# EAGLE design Cleanroom Nano (EAGLE 6.2)
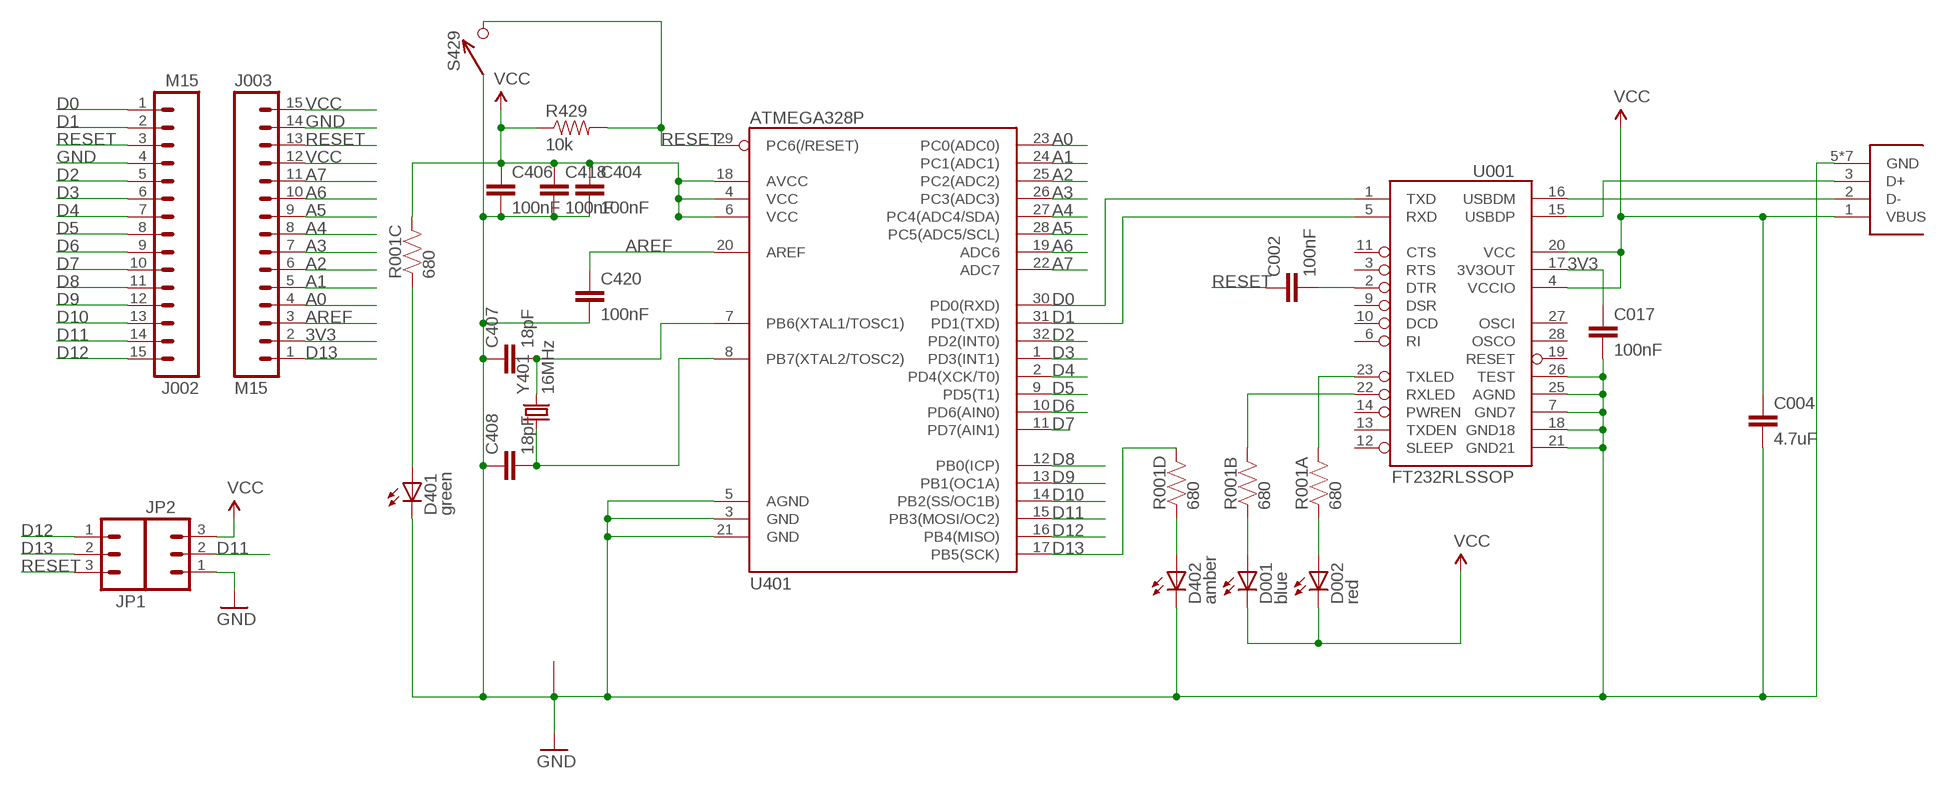
[diagram p0: schematic, sheet 1]

## Parts
C002  100nF  CAP0402-CAP  [0402-CAP]
C004  4.7uF  CAP0402-CAP  [0402-CAP]
C017  100nF  CAP0402-CAP  [0402-CAP]
C404  100nF  CAP0402-CAP  [0402-CAP]
C406  100nF  CAP0402-CAP  [0402-CAP]
C407  18pF  CAP0402-CAP  [0402-CAP]
C408  18pF  CAP0402-CAP  [0402-CAP]
C418  100nF  CAP0402-CAP  [0402-CAP]
C420  100nF  CAP0402-CAP  [0402-CAP]
D001  blue  LED0603  [LED-0603]
D002  red  LED0603  [LED-0603]
D401  green  LED0603  [LED-0603]
D402  amber  LED0603  [LED-0603]
J001  USB_MICROB_JST  [UB-MC5BR3-SD204-4S]
J002  M15  [1X15]
J003  M15  [1X15]
JP1  M03PTH  [1X03]
JP2  M03PTH  [1X03]
R001  680  RP404  [CRA04]
R429  10k  RESISTOR0402-RES  [0402-RES]
S429  B3U-1000P  [B3U-1000P]
U001  FT232RLSSOP  [SSOP28DB]
U401  ATMEGA328P  ATMEGA168  [TQFP32-08]
Y401  16MHz  CX2520  [CRYSTAL_SMD_2MM_2_5MM]

## Nets
3V3: C017.1 J003.2 U001.17(3V3OUT)
A0: J003.4 U401.23(PC0(ADC0))
A1: J003.5 U401.24(PC1(ADC1))
A2: J003.6 U401.25(PC2(ADC2))
A3: J003.7 U401.26(PC3(ADC3))
A4: J003.8 U401.27(PC4(ADC4/SDA))
A5: J003.9 U401.28(PC5(ADC5/SCL))
A6: J003.10 U401.19(ADC6)
A7: J003.11 U401.22(ADC7)
AREF: C420.1 J003.3 U401.20(AREF)
D0: J002.1 U001.1(TXD) U401.30(PD0(RXD))
D1: J002.2 U001.5(RXD) U401.31(PD1(TXD))
D2: J002.5 U401.32(PD2(INT0))
D3: J002.6 U401.1(PD3(INT1))
D4: J002.7 U401.2(PD4(XCK/T0))
D5: J002.8 U401.9(PD5(T1))
D6: J002.9 U401.10(PD6(AIN0))
D7: J002.10 U401.11(PD7(AIN1))
D8: J002.11 U401.12(PB0(ICP))
D9: J002.12 U401.13(PB1(OC1A))
D10: J002.13 U401.14(PB2(SS/OC1B))
D11: J002.14 JP2.2 U401.15(PB3(MOSI/OC2))
D12: J002.15 JP1.1 U401.16(PB4(MISO))
D13: J003.1 JP1.2 R001.5 U401.17(PB5(SCK))
DTR#: C002.2 U001.2(DTR)
GND: C004.2 C017.2 C404.2 C406.2 C407.1 C408.1 C418.2 C420.2 D401.C D402.C J001.5(GND) J001.P$6(GND) J001.P$7(GND) J001.P$8(GND) J001.P$9(GND) J001.P$10(GND) J001.P$11(GND) J002.4 J003.14 JP2.1 S429.P$1 U001.7(GND7) U001.18(GND18) U001.21(GND21) U001.25(AGND) U001.26(TEST) U401.3(GND) U401.5(AGND) U401.21(GND) Y401.2 Y401.4
N$1: C407.2 U401.7(PB6(XTAL1/TOSC1)) Y401.3
N$2: C408.2 U401.8(PB7(XTAL2/TOSC2)) Y401.1
N$3: J001.3(D+) U001.15(USBDP)
N$4: J001.2(D-) U001.16(USBDM)
N$5: D401.A R001.3
N$8: D402.A R001.4
N$9: D002.A R001.1
N$11: D001.A R001.2
RESET: C002.1 J002.3 J003.13 JP1.3 R429.2 S429.P$2 U401.29(PC6(/RESET))
RXLED1: R001.7 U001.22(RXLED)
TXLED1: R001.8 U001.23(TXLED)
VCC: C004.1 C404.1 C406.1 C418.1 D001.C D002.C J001.1(VBUS) J003.12 J003.15 JP2.3 R001.6 R429.1 U001.4(VCCIO) U001.20(VCC) U401.4(VCC) U401.6(VCC) U401.18(AVCC)
Unconnected: U001.3(RTS) U001.6(RI) U001.9(DSR) U001.10(DCD) U001.11(CTS) U001.12(SLEEP) U001.13(TXDEN) U001.14(PWREN) U001.19(RESET) U001.27(OSCI) U001.28(OSCO)

## Library data of the parts
C002 C004 C017 C404 C406-C408 C418 C420 = SparkFun:CAP: Capacitor Standard 0603 ceramic capacitor, and 0.1" leaded capacitor.
D001 D002 D401 D402 = SparkFun-LED:LED: LEDs Standard schematic elements and footprints for 5mm, 3mm, 1206, and 0603 sized LEDs. 5mm - Spark Fun Electronics SKU : COM-00529 (and others)
J001 = KwanSystems:USB_MICROB_JST
J002 J003 = SparkFun-Connectors:M15: Header 15 Standard 15-pin 0.1" header. Use with straight break away headers (SKU : PRT-00116), right angle break away headers (PRT-00553), swiss pins (PRT-00743), machine pins (PRT-00117), and female headers (PRT-00115).
JP1 JP2 = SparkFun:M03: Header 3 Standard 3-pin 0.1" header. Use with straight break away headers (SKU : PRT-00116), right angle break away headers (PRT-00553), swiss pins (PRT-00743), machine pins (PRT-00117), and female headers (PRT-00115). Molex polarized connector foot print use with SKU : PRT-08232 with associated crimp pins and housings.
R001 = KwanSystems:RP4
R429 = SparkFun-Passives:RESISTOR: Resistor Basic schematic elements and footprints for 0603, 1206, and PTH resistors.
S429 = KwanSystems:B3U-1000P
U001 = SparkFun-DigitalIC:FT232RL: USB UART FT232RL 4th Generation USB UART (USB <-> Serial) Controller. Spark Fun Electronics SKU : COM-00650
U401 = SparkFun-DigitalIC:ATMEGA168: Atmel 32-pin 8-bit micro, 16k flash.
Y401 = KwanSystems:CX2520

## Net classes
0 default: width 0.152 mm, drill 0.33 mm, clearance 0.152 mm

## Board
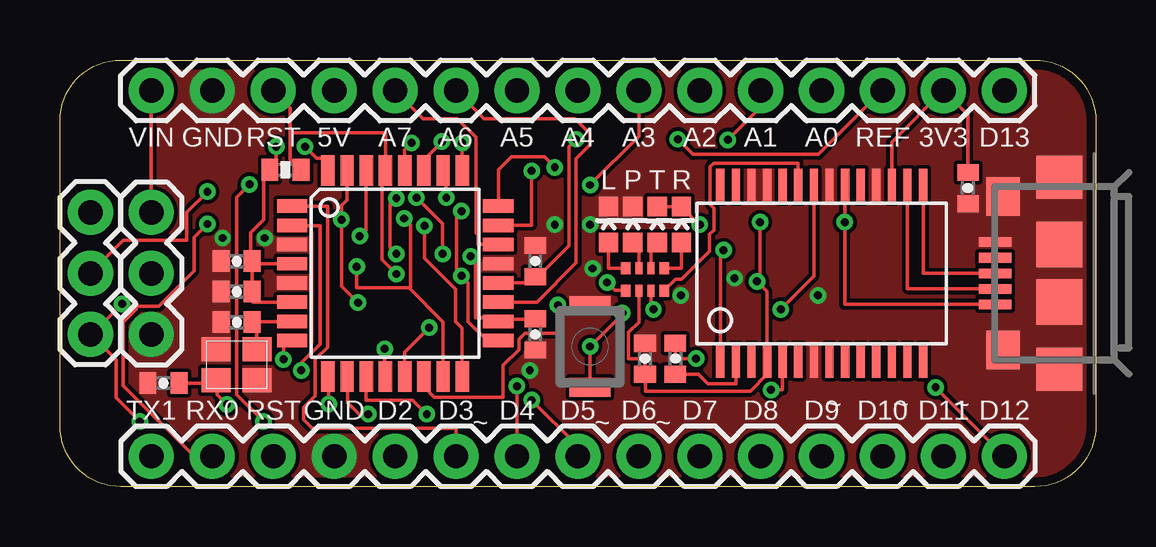
[diagram p1: board, top side]
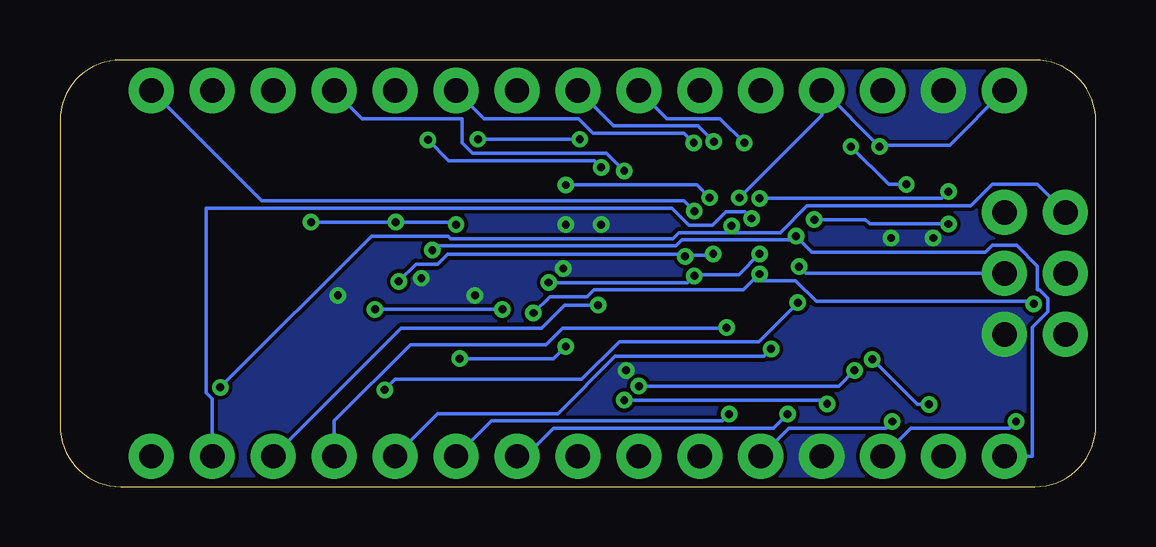
[diagram p2: board, bottom side, seen from below]

Size 43.18 x 17.78 mm. Coordinates in mm from the lower left corner, seen from the top.
Outline: 40.64,0 2.54,0 arc-90 0,2.54 0,15.24 arc-90 2.54,17.78 40.64,17.78 arc-90 43.18,15.24 43.18,2.54 arc-90 40.64,0
Copper layers (1*16): Top 0.0356mm / dielectric 1.5011mm / Bottom 0.0356mm
Design rules: minimum track width 6mil, minimum drill 13mil, track to track 6mil, track to pad 6mil, pad to pad 6mil, via to via 6mil, smd to smd 6mil, copper to edge 15mil, drill to drill 6mil, minimum pad ring 7mil, minimum via ring 7mil, stop-mask expansion 4mil, vias tented up to drill 0mil, thermal gap 10mil

### Footprints (pad centres in the part's own frame; a part is rotated, then mirrored left to right if it is on the bottom)
0402-CAP = smd 0.7 x 0.9: 1 -0.65,0; 2 0.65,0
LED-0603 = smd 0.8 x 0.8: A 0,-0.75; C 0,0.75
UB-MC5BR3-SD204-4S = smd 0.4 x 1.35: 1 -1.3,2.675; 2 -0.65,2.675; 3 0,2.675; 4 0.65,2.675; 5 1.3,2.675 | smd 1.8 x 1.9: P$6 4,0; P$7 -4,0 | smd 1.9 x 1.9: P$8 -1.2,0; P$9 1.2,0 | smd 1.6 x 1.4: P$10 -3.2,2.35; P$11 3.2,2.35
1X15 = drill 1.016 pad 1.88: 1 0,0; 2 2.54,0; 3 5.08,0; 4 7.62,0; 5 10.16,0; 6 12.7,0; 7 15.24,0; 8 17.78,0; 9 20.32,0; 10 22.86,0; 11 25.4,0; 12 27.94,0; 13 30.48,0; 14 33.02,0; 15 35.56,0
1X03 = drill 1.016 pad 1.88: 1 0,0; 2 2.54,0; 3 5.08,0
CRA04 = smd 0.4 x 0.5: 1 -0.8,-0.475; 4 0.8,-0.475; 5 0.8,0.475; 8 -0.8,0.475 | smd 0.3 x 0.5: 2 -0.25,-0.475; 3 0.25,-0.475; 6 0.25,0.475; 7 -0.25,0.475
0402-RES = smd 0.7 x 0.9: 1 -0.65,0; 2 0.65,0
B3U-1000P = smd 0.8 x 1.7: P$1 -1.7,0; P$2 1.7,0
SSOP28DB = smd 0.348 x 1.397: 1 -4.225,-3.656; 2 -3.575,-3.656; 3 -2.925,-3.656; 4 -2.275,-3.656; 5 -1.625,-3.656; 6 -0.975,-3.656; 7 -0.325,-3.656; 8 0.325,-3.656; 9 0.975,-3.656; 10 1.625,-3.656; 11 2.275,-3.656; 12 2.925,-3.656; 13 3.575,-3.656; 14 4.225,-3.656; 15 4.225,3.656; 16 3.575,3.656; 17 2.925,3.656; 18 2.275,3.656; 19 1.625,3.656; 20 0.975,3.656; 21 0.325,3.656; 22 -0.325,3.656; 23 -0.975,3.656; 24 -1.625,3.656; 25 -2.275,3.656; 26 -2.925,3.656; 27 -3.575,3.656; 28 -4.225,3.656
TQFP32-08 = smd 1.27 x 0.559: 1 -4.293,2.8; 2 -4.293,2; 3 -4.293,1.2; 4 -4.293,0.4; 5 -4.293,-0.4; 6 -4.293,-1.2; 7 -4.293,-2; 8 -4.293,-2.8; 17 4.293,-2.8; 18 4.293,-2; 19 4.293,-1.2; 20 4.293,-0.4; 21 4.293,0.4; 22 4.293,1.2; 23 4.293,2; 24 4.293,2.8 | smd 0.559 x 1.27: 9 -2.8,-4.293; 10 -2,-4.293; 11 -1.2,-4.293; 12 -0.4,-4.293; 13 0.4,-4.293; 14 1.2,-4.293; 15 2,-4.293; 16 2.8,-4.293; 25 2.8,4.293; 26 2,4.293; 27 1.2,4.293; 28 0.4,4.293; 29 -0.4,4.293; 30 -1.2,4.293; 31 -2,4.293; 32 -2.8,4.293
CRYSTAL_SMD_2MM_2_5MM = smd 1.2 x 1: 1 -0.85,-0.65; 2 0.85,-0.65; 3 0.85,0.65; 4 -0.85,0.65

### Placement (x,y rotation side)
C002  25.65,5.33 270 top
C004  24.38,5.33 90 top
C017  37.85,12.45 270 top
C404  7.37,9.4 180 top
C406  7.37,8.13 180 top
C407  7.37,6.86 0 top
C408  4.32,4.32 0 top
C418  19.81,6.35 270 top
C420  19.81,9.4 90 top
D001  24.89,10.92 0 top
D002  25.91,10.92 0 top
D401  23.88,10.92 0 top
D402  22.86,10.92 0 top
J001  41.66,8.89 90 top
J002  3.81,1.27 0 top
J003  39.37,16.51 180 top
JP1  1.27,11.43 270 top
JP2  3.81,6.35 90 top
R001  24.38,8.64 180 top
R429  9.4,13.21 0 top
S429  22.1,5.84 270 top
U001  31.75,8.89 0 top
U401  13.97,8.89 0 top
Y401  7.37,5.08 0 top

### Tracks (layer width: path | path; a pad name or v marks a point on that pad's centre or on a via)
3V3
  Top 0.152: U001.17 34.67,14.36 J003.2 37.85,15.49 C017.1
A0  (via drill 0.33)
  Top 0.152: v19.66,13.16 19.66,10.9 U401.23
  Bottom 0.152: v19.66,13.16 20.4,13.89 25.98,13.89 26.42,14.33 26.42,15.34 30.58,15.34 J003.4
A1  (via drill 0.33)
  Top 0.152: v27.84,14.45 29.21,15.82 J003.5 | v20.62,13.31 20.19,13.74 18.82,13.74 18.29,13.21 18.29,11.71 U401.24
  Bottom 0.152: v20.62,13.31 20.9,13.59 26.98,13.59 v27.84,14.45
A2  (via drill 0.33)
  Top 0.152: v16.76,14.33 U401.25
  Bottom 0.152: v16.76,14.33 17.17,14.73 20.95,14.73 21.57,15.34 25.5,15.34 J003.6
A3  (via drill 0.33)
  Top 0.152: v16.1,12.04 16.1,13.06 U401.26 | v22.1,12.57 24.13,14.61 J003.7
  Bottom 0.152: v16.1,12.04 16.64,12.57 v22.1,12.57
A4  (via drill 0.33)
  Top 0.152: v15.93,14.38 15.17,13.62 U401.27 15.19,13.18
  Bottom 0.152: v15.93,14.38 16.59,15.04 20.12,15.04 J003.8
A5  (via drill 0.33)
  Top 0.152: U401.28 14.37,14.04 v14.66,14.33
  Bottom 0.152: v14.66,14.33 15.67,15.34 17.88,15.34 J003.9
A6
  Top 0.152: U401.19 19.89,7.7 21.51,9.32 21.51,13.66 22.1,14.25 22.1,14.71 21.46,15.34 17.68,15.34 J003.10
A7
  Top 0.152: U401.22 18.26,10.11 17.42,10.11 17.42,10.49 17.35,10.57 17.35,14.55 16.56,15.34 15.14,15.34 J003.11
AREF  (via drill 0.33)
  Top 0.152: v21.51,14.48 21.21,14.17 21.21,10.03 19.92,8.75 C420.1 | v25.76,14.48 26.39,13.84 31.62,13.84 J003.3 | 19.84,8.81 C420.1 | U401.20 19.55,8.49 arc90 C420.1
  Bottom 0.152: v25.76,14.48 v21.51,14.48
D0  (via drill 0.33)
  Top 0.152: U401.30 12.75,13.18 12.75,10.69 v12.5,10.44 | v27.66,9.86 27.53,9.73 27.53,5.26 U001.1
  Bottom 0.152: J002.1 2.64,1.27 2.64,6.66 2.01,7.29 2.01,7.85 2.36,8.2 2.44,8.2 2.44,9.2 3.3,10.06 4.32,10.06 4.6,9.78 11.84,9.78 v12.5,10.44 12.45,10.29 17.25,10.29 17.5,10.03 27.48,10.03 v27.66,9.86
D1  (via drill 0.33)
  Top 0.152: v6.15,10.95 5.59,10.39 5.59,8.99 4.12,7.52 3.17,7.52 3.17,7.39 2.64,6.86 2.64,4.22 5.59,1.27 J002.2 | U401.31 11.96,11.96 11.73,11.73 v11.73,11.12 11.73,8.36 v12.42,7.67 | U001.5 30.12,4.04 v29.64,4.04
  Bottom 0.152: v29.64,4.04 29.21,4.47 21.44,4.47 19.86,6.04 14.05,6.04 v12.42,7.67 | v11.73,11.12 9.6,11.12 9.42,10.95 v6.15,10.95
D2  (via drill 0.33)
  Top 0.152: v10.21,14.17 10.69,13.69 11.15,13.69 11.15,13.18 U401.32 | v7.9,12.6 7.37,12.06 7.37,3.83 v8.48,2.72
  Bottom 0.152: v10.21,14.17 8.64,12.6 v7.9,12.6 | v8.48,2.72 8.76,2.44 12.8,2.44 J002.5
D3
  Top 0.152: J002.6 16.51,2.44 10.52,2.44 10.16,2.79 10.16,3.3 10.64,3.79 10.64,5.31 11.15,5.82 11.15,11.68 U401.1
D4  (via drill 0.33)
  Top 0.152: v10.06,4.85 10.06,5.16 10.85,5.94 10.85,10.87 9.68,10.87 U401.2 | J002.7 v19.05,4.19
  Bottom 0.152: v10.06,4.85 10.72,4.19 v19.05,4.19
D5  (via drill 0.33)
  Top 0.152: v19.66,3.61 21.59,1.68 J002.8 | U401.9 11.2,4.6 v11.2,3.45
  Bottom 0.152: v19.66,3.61 11.2,3.61 v11.2,3.45
D6  (via drill 0.33)
  Top 0.152: U401.10 11.99,4.6 11.99,3.5 12.47,3.02 v12.85,3.02
  Bottom 0.152: v12.85,3.02 13.44,2.44 22.61,2.44 23.77,1.27 J002.9
D7  (via drill 0.33)
  Top 0.152: U401.11 12.77,3.61 14.71,3.61 v15.29,3.02
  Bottom 0.152: v15.29,3.02 15.57,2.74 25.2,2.74 J002.10
D8  (via drill 0.33)
  Top 0.152: v13.54,5.74 13.54,4.62 U401.12
  Bottom 0.152: v13.54,5.74 13.84,5.44 20.04,5.44 22.43,3.05 27.43,3.05 J002.11
D9  (via drill 0.33)
  Top 0.152: v15.39,6.63 14.37,5.61 U401.13
  Bottom 0.152: J002.12 31.75,2.74 28.57,5.92 22.91,5.92 22.23,6.6 15.42,6.6 v15.39,6.63
D10  (via drill 0.33)
  Top 0.152: v20.75,7.57 20.75,6.4 19.38,6.4 19.13,6.15 19.13,5.71 18.47,5.05 18.47,3.73 15.6,3.73 15.19,4.14 15.19,4.6 U401.14
  Bottom 0.152: J002.13 28.96,6.6 23.11,6.6 22.15,7.57 v20.75,7.57
D11  (via drill 0.33)
  Top 0.152: 14.55,8.28 15.98,6.86 U401.15 | 14.55,8.28 12.37,8.28 v12.37,9.17 | v14.35,11.18 14.61,10.92 14.61,8.33 14.55,8.28
  Bottom 0.152: v12.37,9.17 12.09,8.89 JP2.2 | J002.14 36.83,3.66 37.08,3.91 37.08,11.61 17.68,11.61 16.97,10.9 15.98,10.9 15.42,11.46 14.63,11.46 v14.35,11.18
D12  (via drill 0.33)
  Top 0.152: v15.19,10.87 15.19,9.53 16.48,8.23 16.48,6.88 16.76,6.6 U401.16 | v36.5,4.14 J002.15
  Bottom 0.152: JP1.1 2.44,12.6 4.32,12.6 5.21,11.71 12.04,11.71 13.16,10.59 14.91,10.59 v15.19,10.87 15.01,10.59 17.37,10.59 17.63,10.34 26.9,10.34 27,10.44 30.2,10.44 v36.5,4.14
D13  (via drill 0.33)
  Top 0.152: R001.5 23.57,8.18 23.14,8.18 v22.81,8.51 | U401.17 17.8,6.1 17.02,6.88 17.02,8.51 v16.74,8.79 16.54,8.99 16.54,11.28 v16.74,11.48 | JP1.2 2.64,10.26 5.28,10.26 5.28,11.43 v6.15,12.29 | v14.02,12.01 13.77,11.76 13.77,9.96 v14.02,9.7
  Bottom 0.152: v22.81,8.51 17.02,8.51 v16.74,8.79 16.69,8.84 14.88,8.84 v14.02,9.7 | J003.1 34.77,11.91 17.17,11.91 v16.74,11.48 | v6.15,12.29 6.43,12.01 v14.02,12.01
DTR#
  Top 0.152: C002.2 26.61,4.68 27,4.29 28.17,4.29 U001.2
GND  (via drill 0.33)
  other vias: 8.53,10.36 6.78,10.36 25.88,7.98 22.2,9.09 28.12,8.69 20.62,10.92 22.1,10.92 31.6,7.98 19.58,4.85
  pour Bottom (no thermals): 40.64,0 2.54,0 arc-90 0,2.54 0,15.24 arc-90 2.54,17.78 40.64,17.78 arc-90 43.18,15.24 43.18,2.54 arc-90
  pour Top (no thermals): 40.64,0 2.54,0 arc-90 0,2.54 0,15.24 arc-90 2.54,17.78 40.64,17.78 arc-90 43.18,15.24 43.18,2.54 arc-90
N$1
  Top 0.152: Y401.3 8.2,5.74 8.2,6.68 C407.2 8.26,6.73 8.26,6.88 U401.7
N$2  (via drill 0.33)
  Top 0.152: C408.2 6.5,4.32 6.5,4.42 Y401.1 6.55,4.27 6.55,3.83 v6.96,3.43 | 9.32,5.71 v9.32,5.31 9.32,6.07 9.68,6.07 U401.8
  Bottom 0.152: v9.32,5.31 7.44,3.43 v6.96,3.43
N$3
  Top 0.152: J001.3 35.99,8.89 35.99,12.52 U001.15
N$4
  Top 0.152: J001.2 38.96,8.26 35.33,8.26 35.33,12.52 U001.16
N$5
  Top 0.152: R001.3 24.13,9.91 D401.A
N$8
  Top 0.152: R001.4 22.86,9.11 D402.A
N$9
  Top 0.152: R001.1 25.91,9.11 D002.A
N$11
  Top 0.152: R001.2 24.63,9.91 D001.A
RESET  (via drill 0.33)
  Top 0.152: v3.33,2.72 2.34,3.71 2.34,5.28 JP1.3 1.35,6.38 v2.59,7.62 | C002.1 25.65,5.33 v26.52,5.33 | 22.1,4.17 S429.P$2 v22.1,5.84 23.44,7.19 v23.44,7.24 | 9.6,14.76 9.6,15.8 J003.13 | 9.6,14.76 9.6,13.64 10.03,13.21 R429.2 | 9.6,14.76 13.57,14.76 U401.29 | U401.29 13.56,13.56 | v14.02,8.87 13.44,9.45 13.44,13.21 U401.29
  Bottom 0.152: v3.33,2.72 3.61,2.44 7.72,2.44 J002.3 | v23.44,7.24 22.76,7.92 21.21,7.92 20.93,8.2 14.68,8.2 v14.02,8.87 14.2,8.59 12.52,8.59 11.66,7.72 2.69,7.72 v2.59,7.62 | v22.1,5.84 22.61,5.33 v26.52,5.33
RXLED1  (via drill 0.33)
  Top 0.152: v30.05,7.39 31.42,8.76 31.42,12.52 U001.22 | R001.7 24.64,7.49 v24.74,7.39
  Bottom 0.152: v30.05,7.39 v24.74,7.39
TXLED1
  Top 0.152: 25.2,8.18 R001.8 25.66,8.64 25.91,8.64 27.08,9.8 27.08,10.52 27.25,10.69 27.25,11.61 27.1,11.76 27.1,13.34 27.25,13.49 30.76,13.49 U001.23
VCC  (via drill 0.33)
  Top 0.152: JP2.3 J003.15 | C404.1 8,9.4 7.95,9.45 7.95,10.59 8.48,11.12 8.48,12.95 8.74,13.21 R429.1 8.79,13.26 9.02,13.49 v9.02,14.17 | C404.1 8,9.35 8,8.13 C406.1 8.05,8.08 8.05,7.7 U401.6 | U401.4 8.05,9.3 C404.1 | C418.1 19.81,6.99 18.26,6.99 U401.18 18.21,7.04 17.32,7.04 17.32,9.4 v17.12,9.6 | R001.6 24.13,6.86 23.7,6.43 23.7,5.33 24.38,5.33 C004.1 24.41,4.62 24.41,3.99 28.78,3.99 29.48,4.68 U001.4 | 29.46,5.23 U001.4 | U001.4 29.46,5.31 29.46,8.15 v29.06,8.56 29.18,8.69 v29.18,11.02 | D001.C D002.C 25.96,11.61 26.64,10.92 v26.67,10.92 | 32.72,12.52 U001.20 32.72,12.55 v32.72,11.02 32.72,7.59 38.96,7.59 J001.1 | v14.86,12.04 15.95,10.95 v15.95,9.7
  Bottom 0.152: J003.12 11.35,16.51 v9.02,14.17 8.97,14.22 6.1,14.22 J003.15 | v29.06,8.56 28.35,9.27 27.43,9.27 27.03,9.68 17.2,9.68 v17.12,9.6 17.07,9.65 16,9.65 v15.95,9.7 | v26.67,10.92 26.77,11.02 v29.18,11.02 v32.72,11.02 | 10.92,15.98 J003.12 | J003.12 11.43,15.47 v14.86,12.04

### Text on the board
tPlace: VIN | GND | RST | 5V | A7 | A6 | A5 | A4 | A3 | A2 | A1 | A0 | REF | 3V3 | D13 | L | P | T | R | TX1 | RX0 | RST | GND | D2 | D3 | D4 | D5 | D6 | D7 | D8 | D9 | ~ | D10 | ~ | D11 | ~ | D12 | ~ | ~ | ~